# Altium schematic sheet RP_INTERFACE_BOARD_V4.1.SchDoc
size 584 x 413 mm
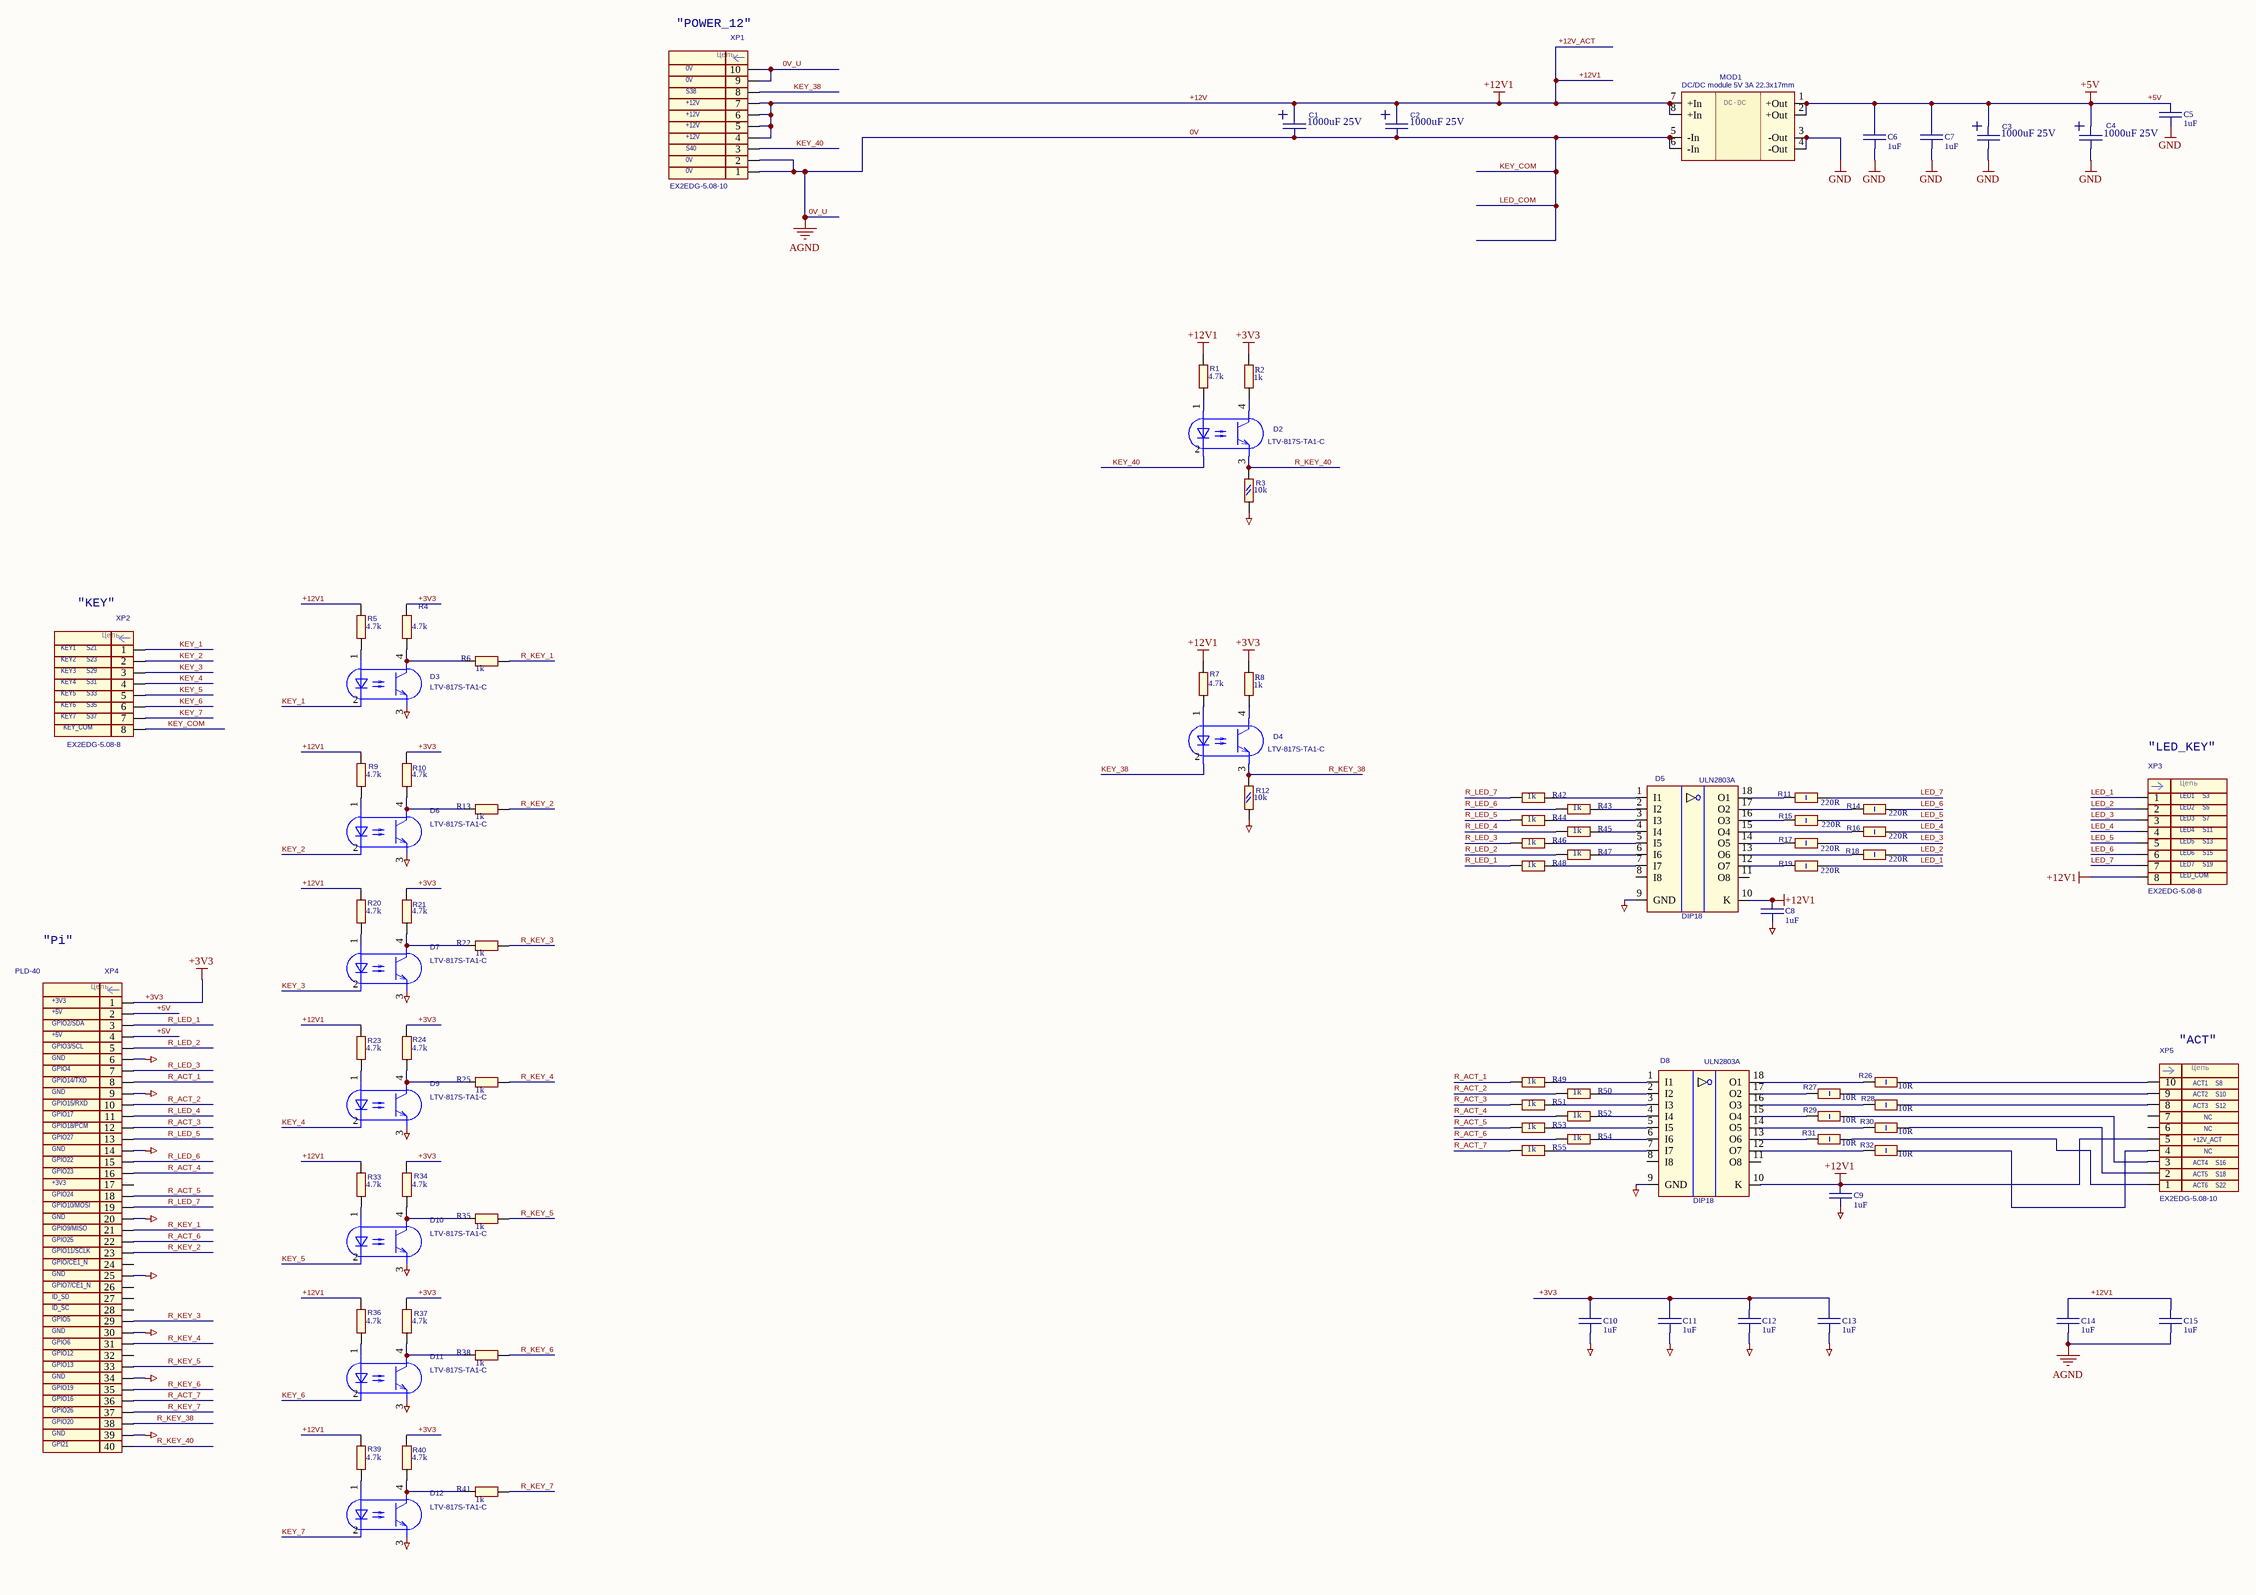
[diagram p0: RP_INTERFACE_BOARD_V4.1.SchDoc]

## Parts
C1  EXR102M25B  [RADIAL 13X25]  (value not drawn)
C2  EXR102M25B  [RADIAL 13X25]  (value not drawn)
C3  EXR102M25B  [RADIAL 13X25]  (value not drawn)
C4  EXR102M25B  [RADIAL 13X25]  (value not drawn)
C5  C0805, 1uF, 50V, X7R  [C0805]  (value not drawn)
C6  C0805, 1uF, 50V, X7R  [C0805]  (value not drawn)
C7  C0805, 1uF, 50V, X7R  [C0805]  (value not drawn)
C8  C0805, 1uF, 50V, X7R  [C0805]  (value not drawn)
C9  C0805, 1uF, 50V, X7R  [C0805]  (value not drawn)
C10  C0805, 1uF, 50V, X7R  [C0805]  (value not drawn)
C11  C0805, 1uF, 50V, X7R  [C0805]  (value not drawn)
C12  C0805, 1uF, 50V, X7R  [C0805]  (value not drawn)
C13  C0805, 1uF, 50V, X7R  [C0805]  (value not drawn)
C14  C0805, 1uF, 50V, X7R  [C0805]  (value not drawn)
C15  C0805, 1uF, 50V, X7R  [C0805]  (value not drawn)
D2  LTV-817S-TA1-C  [SOIC4]
D3  LTV-817S-TA1-C  [SOIC4]
D4  LTV-817S-TA1-C  [SOIC4]
D5  ULN2803A  Korpus3: DIP18  [DIP18_DIP762W46P254L2286H533Q18P]
D6  LTV-817S-TA1-C  [SOIC4]
D7  LTV-817S-TA1-C  [SOIC4]
D8  ULN2803A  Korpus3: DIP18  [DIP18_DIP762W46P254L2286H533Q18P]
D9  LTV-817S-TA1-C  [SOIC4]
D10  LTV-817S-TA1-C  [SOIC4]
D11  LTV-817S-TA1-C  [SOIC4]
D12  LTV-817S-TA1-C  [SOIC4]
MOD1  DC/DC module 5V 3A 22.3x17mm  [DC_DC_module 5V, 17x22.3mm]
R1  value 4.7k  [R0805]  (hidden comment: R0805, 4.7k, 5%)
R2  R0805, 1k, 5%  [R0805]  (value not drawn)
R3  value 10k  [R0805]  (hidden comment: R0805, 10k, 5%)
R4  value 4.7k  [R0805]  (hidden comment: R0805, 4.7k, 5%)
R5  value 4.7k  [R0805]  (hidden comment: R0805, 4.7k, 5%)
R6  R0805, 1k, 5%  [R0805]  (value not drawn)
R7  value 4.7k  [R0805]  (hidden comment: R0805, 4.7k, 5%)
R8  R0805, 1k, 5%  [R0805]  (value not drawn)
R9  value 4.7k  [R0805]  (hidden comment: R0805, 4.7k, 5%)
R10  value 4.7k  [R0805]  (hidden comment: R0805, 4.7k, 5%)
R11  R1206, 220R, 5%  [R1206]  (value not drawn)
R12  value 10k  [R0805]  (hidden comment: R0805, 10k, 5%)
R13  R0805, 1k, 5%  [R0805]  (value not drawn)
R14  R1206, 220R, 5%  [R1206]  (value not drawn)
R15  R1206, 220R, 5%  [R1206]  (value not drawn)
R16  R1206, 220R, 5%  [R1206]  (value not drawn)
R17  R1206, 220R, 5%  [R1206]  (value not drawn)
R18  R1206, 220R, 5%  [R1206]  (value not drawn)
R19  R1206, 220R, 5%  [R1206]  (value not drawn)
R20  value 4.7k  [R0805]  (hidden comment: R0805, 4.7k, 5%)
R21  value 4.7k  [R0805]  (hidden comment: R0805, 4.7k, 5%)
R22  R0805, 1k, 5%  [R0805]  (value not drawn)
R23  value 4.7k  [R0805]  (hidden comment: R0805, 4.7k, 5%)
R24  value 4.7k  [R0805]  (hidden comment: R0805, 4.7k, 5%)
R25  R0805, 1k, 5%  [R0805]  (value not drawn)
R26  R1206, 10R, 5%  [R1206]  (value not drawn)
R27  R1206, 10R, 5%  [R1206]  (value not drawn)
R28  R1206, 10R, 5%  [R1206]  (value not drawn)
R29  R1206, 10R, 5%  [R1206]  (value not drawn)
R30  R1206, 10R, 5%  [R1206]  (value not drawn)
R31  R1206, 10R, 5%  [R1206]  (value not drawn)
R32  R1206, 10R, 5%  [R1206]  (value not drawn)
R33  value 4.7k  [R0805]  (hidden comment: R0805, 4.7k, 5%)
R34  value 4.7k  [R0805]  (hidden comment: R0805, 4.7k, 5%)
R35  R0805, 1k, 5%  [R0805]  (value not drawn)
R36  value 4.7k  [R0805]  (hidden comment: R0805, 4.7k, 5%)
R37  value 4.7k  [R0805]  (hidden comment: R0805, 4.7k, 5%)
R38  R0805, 1k, 5%  [R0805]  (value not drawn)
R39  value 4.7k  [R0805]  (hidden comment: R0805, 4.7k, 5%)
R40  value 4.7k  [R0805]  (hidden comment: R0805, 4.7k, 5%)
R41  R0805, 1k, 5%  [R0805]  (value not drawn)
R42  R0805, 1k, 5%  [R0805]  (value not drawn)
R43  R0805, 1k, 5%  [R0805]  (value not drawn)
R44  R0805, 1k, 5%  [R0805]  (value not drawn)
R45  R0805, 1k, 5%  [R0805]  (value not drawn)
R46  R0805, 1k, 5%  [R0805]  (value not drawn)
R47  R0805, 1k, 5%  [R0805]  (value not drawn)
R48  R0805, 1k, 5%  [R0805]  (value not drawn)
R49  R0805, 1k, 5%  [R0805]  (value not drawn)
R50  R0805, 1k, 5%  [R0805]  (value not drawn)
R51  R0805, 1k, 5%  [R0805]  (value not drawn)
R52  R0805, 1k, 5%  [R0805]  (value not drawn)
R53  R0805, 1k, 5%  [R0805]  (value not drawn)
R54  R0805, 1k, 5%  [R0805]  (value not drawn)
R55  R0805, 1k, 5%  [R0805]  (value not drawn)
XP1  EX2EDG-5.08-10  [5P08-10N]
XP2  EX2EDG-5.08-8  [5P08-8N]
XP3  EX2EDG-5.08-8  [5P08-8N]
XP4  PLD-40  [PLD-40]
XP5  EX2EDG-5.08-10  [5P08-10N]

## Nets
0V: C1.1 C2.1 C14.2 C15.2 MOD1.5(-In) MOD1.6(-In) XP1.1 XP1.2 XP1.9 XP1.10 XP2.8  [also labelled 0V_U, AGND, KEY_COM, LED_COM]
+3V3: C10.1 C11.1 C12.1 C13.1 R2.1 R4.1 R8.1 R10.1 R21.1 R24.1 R34.1 R37.1 R40.1 XP4.1
+5V: C3.2 C4.2 C5.1 C6.1 C7.1 MOD1.1(+Out) MOD1.2(+Out) XP4.2 XP4.4
+12V: C1.2 C2.2 C8.1 C9.1 C14.1 C15.1 D5.10(K) D8.10(K) MOD1.7(+In) MOD1.8(+In) R1.1 R5.1 R7.1 R9.1 R20.1 R23.1 R33.1 R36.1 R39.1 XP1.4 XP1.5 XP1.6 XP1.7 XP3.8 XP5.5  [also labelled +12V1, +12V_ACT]
GND: C3.1 C4.1 C5.2 C6.2 C7.2 C8.2 C9.2 C10.2 C11.2 C12.2 C13.2 D3.3 D5.9(GND) D6.3 D7.3 D8.9(GND) D9.3 D10.3 D11.3 D12.3 MOD1.3(-Out) MOD1.4(-Out) R3.2 R12.2 XP4.6 XP4.9 XP4.14 XP4.20 XP4.25 XP4.30 XP4.34 XP4.39
KEY_1: D3.2 XP2.1
KEY_2: D6.2 XP2.2
KEY_3: D7.2 XP2.3
KEY_4: D9.2 XP2.4
KEY_5: D10.2 XP2.5
KEY_6: D11.2 XP2.6
KEY_7: D12.2 XP2.7
KEY_38: D4.2 XP1.8
KEY_40: D2.2 XP1.3
LED_1: R19.2 XP3.1
LED_2: R18.2 XP3.2
LED_3: R17.2 XP3.3
LED_4: R16.2 XP3.4
LED_5: R15.2 XP3.5
LED_6: R14.2 XP3.6
LED_7: R11.2 XP3.7
R_ACT_1: R49.2 XP4.8
R_ACT_2: R50.2 XP4.10
R_ACT_3: R51.2 XP4.12
R_ACT_4: R52.2 XP4.16
R_ACT_5: R53.2 XP4.18
R_ACT_6: R54.2 XP4.22
R_ACT_7: R55.2 XP4.36
R_KEY_1: R6.1 XP4.21
R_KEY_2: R13.1 XP4.23
R_KEY_3: R22.1 XP4.29
R_KEY_4: R25.1 XP4.31
R_KEY_5: R35.1 XP4.33
R_KEY_6: R38.1 XP4.35
R_KEY_7: R41.1 XP4.37
R_KEY_38: D4.3 R12.1 XP4.38
R_KEY_40: D2.3 R3.1 XP4.40
R_LED_1: R48.2 XP4.3
R_LED_2: R47.2 XP4.5
R_LED_3: R46.2 XP4.7
R_LED_4: R45.2 XP4.11
R_LED_5: R44.2 XP4.13
R_LED_6: R43.2 XP4.15
R_LED_7: R42.2 XP4.19
NetD2_1: D2.1 R1.2
NetD2_4: D2.4 R2.2
NetD3_1: D3.1 R5.2
NetD3_4: D3.4 R4.2 R6.2
NetD4_1: D4.1 R7.2
NetD4_4: D4.4 R8.2
NetD5_1: D5.1(I1) R42.1
NetD5_2: D5.2(I2) R43.1
NetD5_3: D5.3(I3) R44.1
NetD5_4: D5.4(I4) R45.1
NetD5_5: D5.5(I5) R46.1
NetD5_6: D5.6(I6) R47.1
NetD5_7: D5.7(I7) R48.1
NetD5_12: D5.12(O7) R19.1
NetD5_13: D5.13(O6) R18.1
NetD5_14: D5.14(O5) R17.1
NetD5_15: D5.15(O4) R16.1
NetD5_16: D5.16(O3) R15.1
NetD5_17: D5.17(O2) R14.1
NetD5_18: D5.18(O1) R11.1
NetD6_1: D6.1 R9.2
NetD6_4: D6.4 R10.2 R13.2
NetD7_1: D7.1 R20.2
NetD7_4: D7.4 R21.2 R22.2
NetD8_1: D8.1(I1) R49.1
NetD8_2: D8.2(I2) R50.1
NetD8_3: D8.3(I3) R51.1
NetD8_4: D8.4(I4) R52.1
NetD8_5: D8.5(I5) R53.1
NetD8_6: D8.6(I6) R54.1
NetD8_7: D8.7(I7) R55.1
NetD8_12: D8.12(O7) R32.2
NetD8_13: D8.13(O6) R31.2
NetD8_14: D8.14(O5) R30.2
NetD8_15: D8.15(O4) R29.2
NetD8_16: D8.16(O3) R28.2
NetD8_17: D8.17(O2) R27.2
NetD8_18: D8.18(O1) R26.2
NetD9_1: D9.1 R23.2
NetD9_4: D9.4 R24.2 R25.2
NetD10_1: D10.1 R33.2
NetD10_4: D10.4 R34.2 R35.2
NetD11_1: D11.1 R36.2
NetD11_4: D11.4 R37.2 R38.2
NetD12_1: D12.1 R39.2
NetD12_4: D12.4 R40.2 R41.2
NetR26_1: R26.1 XP5.10
NetR27_1: R27.1 XP5.9
NetR28_1: R28.1 XP5.8
NetR29_1: R29.1 XP5.3
NetR30_1: R30.1 XP5.2
NetR31_1: R31.1 XP5.1
NetR32_1: R32.1 XP5.4

Not connected (* = marked no-connect by the designer): D5 8(I8) 11(O8); D8 8(I8) 11(O8); XP4 17 24 26 27 28 32; XP5 6 7

## Notes on the sheet
- (near XP1) "POWER_12"
- 0V
- +12V
- S38
- S40
- "KEY"
- KEY1
- KEY2
- (near XP2) S23
- (near XP2) S21
- KEY3
- KEY4
- KEY5
- KEY6
- KEY7
- (near XP2) S31
- (near XP2) S29
- (near XP2) S33
- (near XP2) S35
- (near XP2) S37
- (near XP2) KEY_COM
- (near XP3) "LED_KEY"
- (near XP3) LED3
- (near XP3) LED4
- (near XP3) LED1
- (near XP3) LED2
- S7
- S11
- S3
- S5
- (near XP3) LED5
- (near XP3) LED7
- (near XP3) LED6
- (near XP3) LED_COM
- S13
- S19
- S15
- "Pi"
- +5V
- +3V3
- (near XP4) GPIO2/SDA
- (near XP4) GPIO3/SCL
- GND
- GPIO4
- (near XP5) "ACT"
- (near XP4) GPIO15/RXD
- (near XP4) GPIO18/PCM
- GPIO17
- (near XP4) GPIO14/TXD
- (near XP5) ACT3
- (near XP5) ACT1
- (near XP5) ACT2
- (near XP5) NC
- S12
- S8
- S10
- GPIO27
- GPIO23
- GPIO22
- (near XP5) ACT5
- (near XP5) ACT4
- (near XP5) ACT6
- (near XP5) +12V_ACT
- S18
- S16
- S22
- GPIO25
- GPIO24
- (near XP4) GPIO10/MOSI
- (near XP4) GPIO9/MISO
- (near XP4) GPIO/CE1_N
- (near XP4) GPIO11/SCLK
- (near XP4) GPIO7/CE1_N
- ID_SD
- GPIO5
- GPIO6
- ID_SC
- GPIO12
- GPIO13
- GPIO19
- GPIO16
- GPIO26
- GPIO20
- GPI21
- (in symbol C0805, 1uF, 50V, X7R) 1uF
- (in symbol DC/DC module 5V 3A 22.3x17mm) DC-DC
- (in symbol EX2EDG-5.08-8) Цепь
- (in symbol EX2EDG-5_0.08-10) Цепь
- (in symbol EXR102M25B) 1000uF 25V
- (in symbol PLD-40) Цепь
- (in symbol R0805, 1k, 5%) 1k
- (in symbol R1206, 10R, 5%) 10R
- (in symbol R1206, 220R, 5%) 220R

## Library data of the parts
C1-C4 = EXR102M25B: 1000uF 25V 13x21mm
D2-D4 D6 D7 D9-D12 = LTV-817S-TA1-C: Optoisolator Transistor Output 5000Vrms 1 Channel 4-SMD
D5 D8 = ULN2803A: Eight Darlington array, DIP-18; Type: Микросхема
XP1 XP5 = EX2EDG-5_0.08-10: Type: Вилка
XP4 = PLD-40: PLD-40, вилка штыревая 2.54мм 2x20 прямая; Type: Вилка
XP2 XP3 = EX2EDG-5.08-8: Type: Вилка